# Altium schematic sheet Leds.SchDoc
size 431 x 279 mm; SheetNumber: 1; SheetTotal: 2
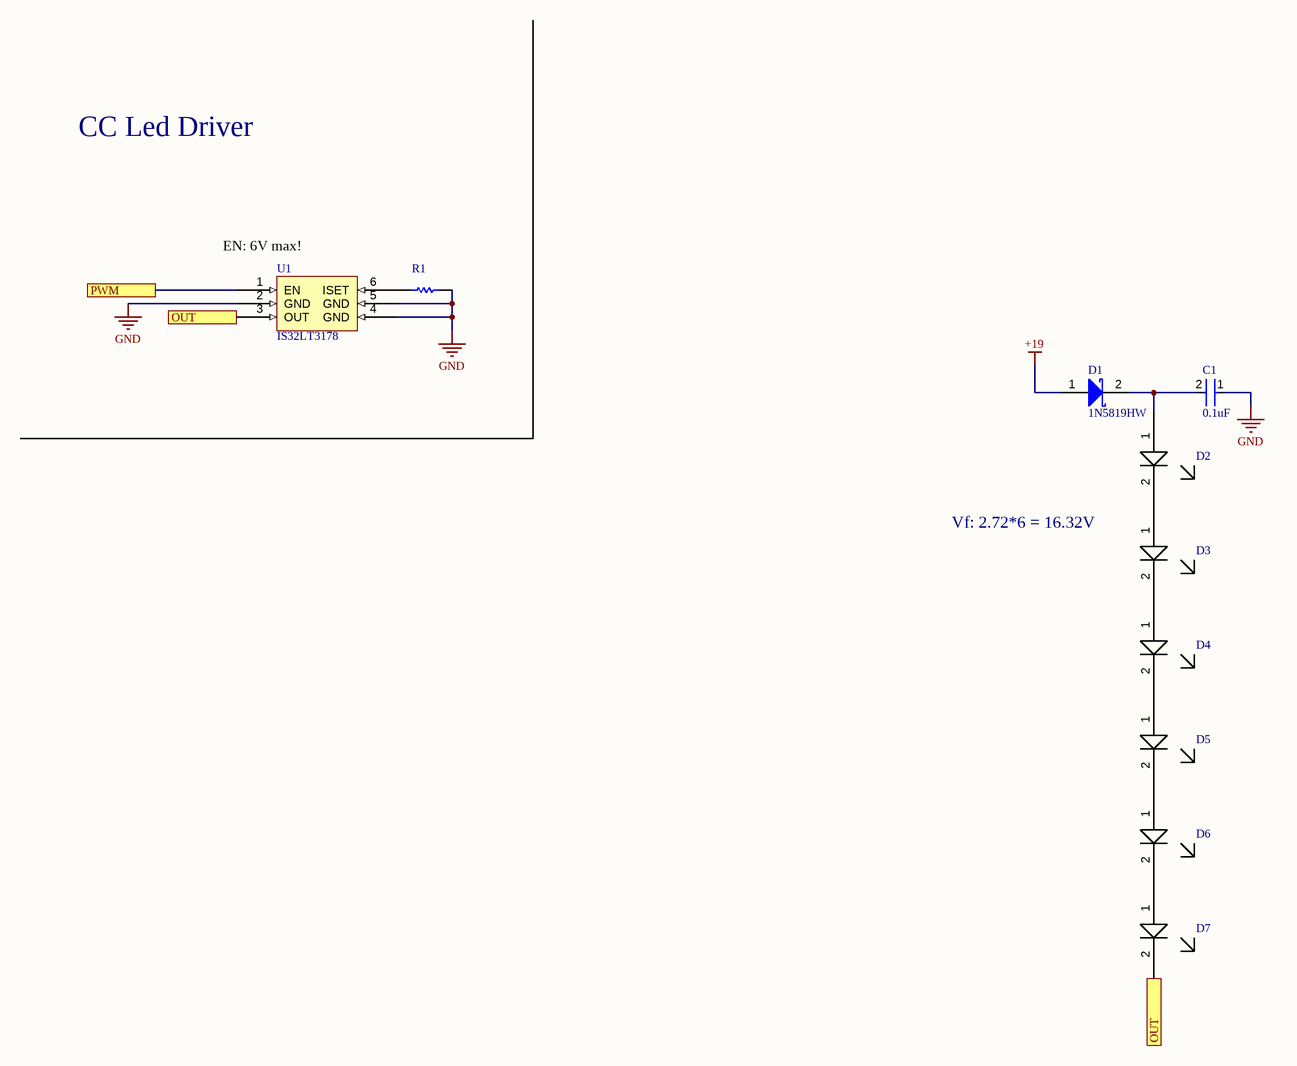
[diagram p0: Leds.SchDoc]

## Parts
C1  0.1uF  [FP-0603-L_1_6_0_15-W_0_81-IPC_A]
D1  1N5819HW  [DIOD-SOD-123-2_V]
D2  S1W0-2835508003  [S1W0-2835508003]  (value not drawn)
D3  S1W0-2835508003  [S1W0-2835508003]  (value not drawn)
D4  S1W0-2835508003  [S1W0-2835508003]  (value not drawn)
D5  S1W0-2835508003  [S1W0-2835508003]  (value not drawn)
D6  S1W0-2835508003  [S1W0-2835508003]  (value not drawn)
D7  S1W0-2835508003  [S1W0-2835508003]  (value not drawn)
R1  (no value)  [RESC1608X55X25ML10T15]
U1  IS32LT3178  [SOT95P280X135-6N]

## Ports
OUT, PWM

## Nets
+19: D1.1(A)
GND: C1.1 R1.1 U1.2(GND) U1.4(GND) U1.5(GND)
OUT: D7.2(C) U1.3(OUT) ; port OUT
PWM: U1.1(EN) ; port PWM
NetC1_2: C1.2 D1.2(K) D2.1(A)
NetD2_2: D2.2(C) D3.1(A)
NetD3_2: D3.2(C) D4.1(A)
NetD4_2: D4.2(C) D5.1(A)
NetD5_2: D5.2(C) D6.1(A)
NetD6_2: D6.2(C) D7.1(A)
NetR1_2: R1.2 U1.6(ISET)

## Notes on the sheet
- CC Led Driver
- (near U1) EN: 6V max!
- Vf: 2.72*6 = 16.32V
- DWG. NO.
- REV.
- SHT.
- THIS DOCUMENT AND THE DATA DISCLOSED HEREIN OR HEREWITH IS THE PROPERTY OF ALTIUM LIMITED AND MAY BE FREELY DISTRIBUTED IN WHOLE. NO RIGHTS ARE RESERVED OR EXPRESS OR IMPLIED WARANTEE GIVEN.
- REVISION
- DESCRIPTION
- DATE
- APPROVED
- ENG:
- APPROVALS
- PROJECT
- DSN:
- CHK:
- REFERENCE DOCUMENTS
- PROJECT REVISION:
- TITLE
- DOCUMENT REVISION:
- DESIGN ITEM:
- BOM:
- FAB DWG:
- PCB DWG:
- ASSY DWG:
- SCALE:
- SIZE
- B
- CAGE CODE
- FILE NAME
- DWG NO.
- SHEET
- OF
- REV

## Library data of the parts
C1 = CMP-2006-04378-2: Capacitance: 1nF; Voltage: 50V; Dielectric: X7R; Tolerance: 10%; Dielectric Material: Ceramic; Case Code (Metric): 1608; Min Operating Temperature: -55°C; Weight: 7.1E-05oz; Series: -; RoHS Compliant: Yes; Radiation Hardening: No; Height: 0.9mm; Mount: Surface Mount; REACH SVHC: No SVHC; Lead Free: Lead Free; Depth: 0.81mm; Number of Pins: 2; Voltage Rating: 50V; Max Operating Temperature: 125°C; Termination: SMD/SMT; Construction: Flat; Case Code (Imperial): 0603; Width: 0.032inch; Case/Package: 0603; Contact Plating: Tin; Packaging: Tape and Reel; Voltage Rating (DC): 50V; Package Quantity: 4000; Thickness: 0.035inch; Length: 1.6mm
D1 = CMP-0303-00003-1: 1.0 A Surface Mount Schottky Barrier Rectifier, 40 V, -65 to 125 degC, 2-Pin SOD-123 Package, RoHS, Tape and Reel; PartNumber: 1N5819HW-7-F; Manufacturer: Diodes Inc; @ VR (V): 40; @ Terminal Temperature TT (degC): 90; Maximum Average Rectified Current IO (A): 1; Total Capacitance CT (pF): 50; Peak Forward Surge Current IFSM (A): 25; Forward Voltage Drop VF (V): 0.45; VR (RMS) (V): 28; RoHS: TRUE; ComponentLink2URL: http://www.diodes.com/datasheets/ds30217.pdf; PackageDescription: 2-Pin SOD-123, Body 2.7 x 1.55 mm, Pitch 3.7 mm; @ IF (A): 1; Operating and Storage Temperature Range: -65 to 125 degC; ComponentLink1Description: Manufacturer URL; ComponentLink2Description: Datasheet; ComponentLink1URL: http://www.diodes.com/; Mounting Technology: Surface Mount; DatasheetVersion: Rev. 15-2; PackageReference: SOD-123-2; Maximum Reverse Current IR (uA): 50; Peak Repetitive Reverse Voltage VRRM (V): 40; Packing: Tape and Reel
D2-D7 = S1W0-2835508003: LED, Cool 5000K 2.72V 65mA 120° 1411 (3528 Metric)
R1 = CMP-2100-03667-1: Manufacturer: Yageo; Temperature Coefficient: 200ppm/degreesC; Tolerance: 5%; Voltage Rating: 50V; Power Rating: 100mW; Resistance: 0mOhm; Width: 0.8mm; Max Operating Temperature: 155degC; Package Reference: 0603; Height: 0.45mm; Depth: 0.8mm; Package Description: 2-Pin Surface Mount Device, Body 1.6 x 0.8 mm; Termination: SMD/SMT; Package Quantity: 5000; Case/Package: 0603; Case Code (Imperial): 0603; Radiation Hardening: No; Number of Pins: 2; Length: 1.6mm; Lead Free: LeadFree; Voltage Rating (DC): 50V; Military Standard: Not; Datasheet URL: http://www.yageo.com/NewPortal/yageodocoutput?fileName=/pdf/R-Chip/PYu-RC_Group_51_RoHS_L_5.pdf; Manufacturer URL: http://www.yageo.com/; Packaging: TapeandReel; Case Code (Metric): 1608; Min Operating Temperature: -55degC; Composition: ThickFilm; RoHSCompliant: true; Contact Plating: Tin; Datasheet Version: Rev. 5, 10/2016; REACH SVHC: NoSVHC
U1 = IS32LT3178: 10 TO 150MA CONSTANT CURRENT REG